# Altium schematic sheet CONTROL_BOARD_V2.SchDoc
size A3
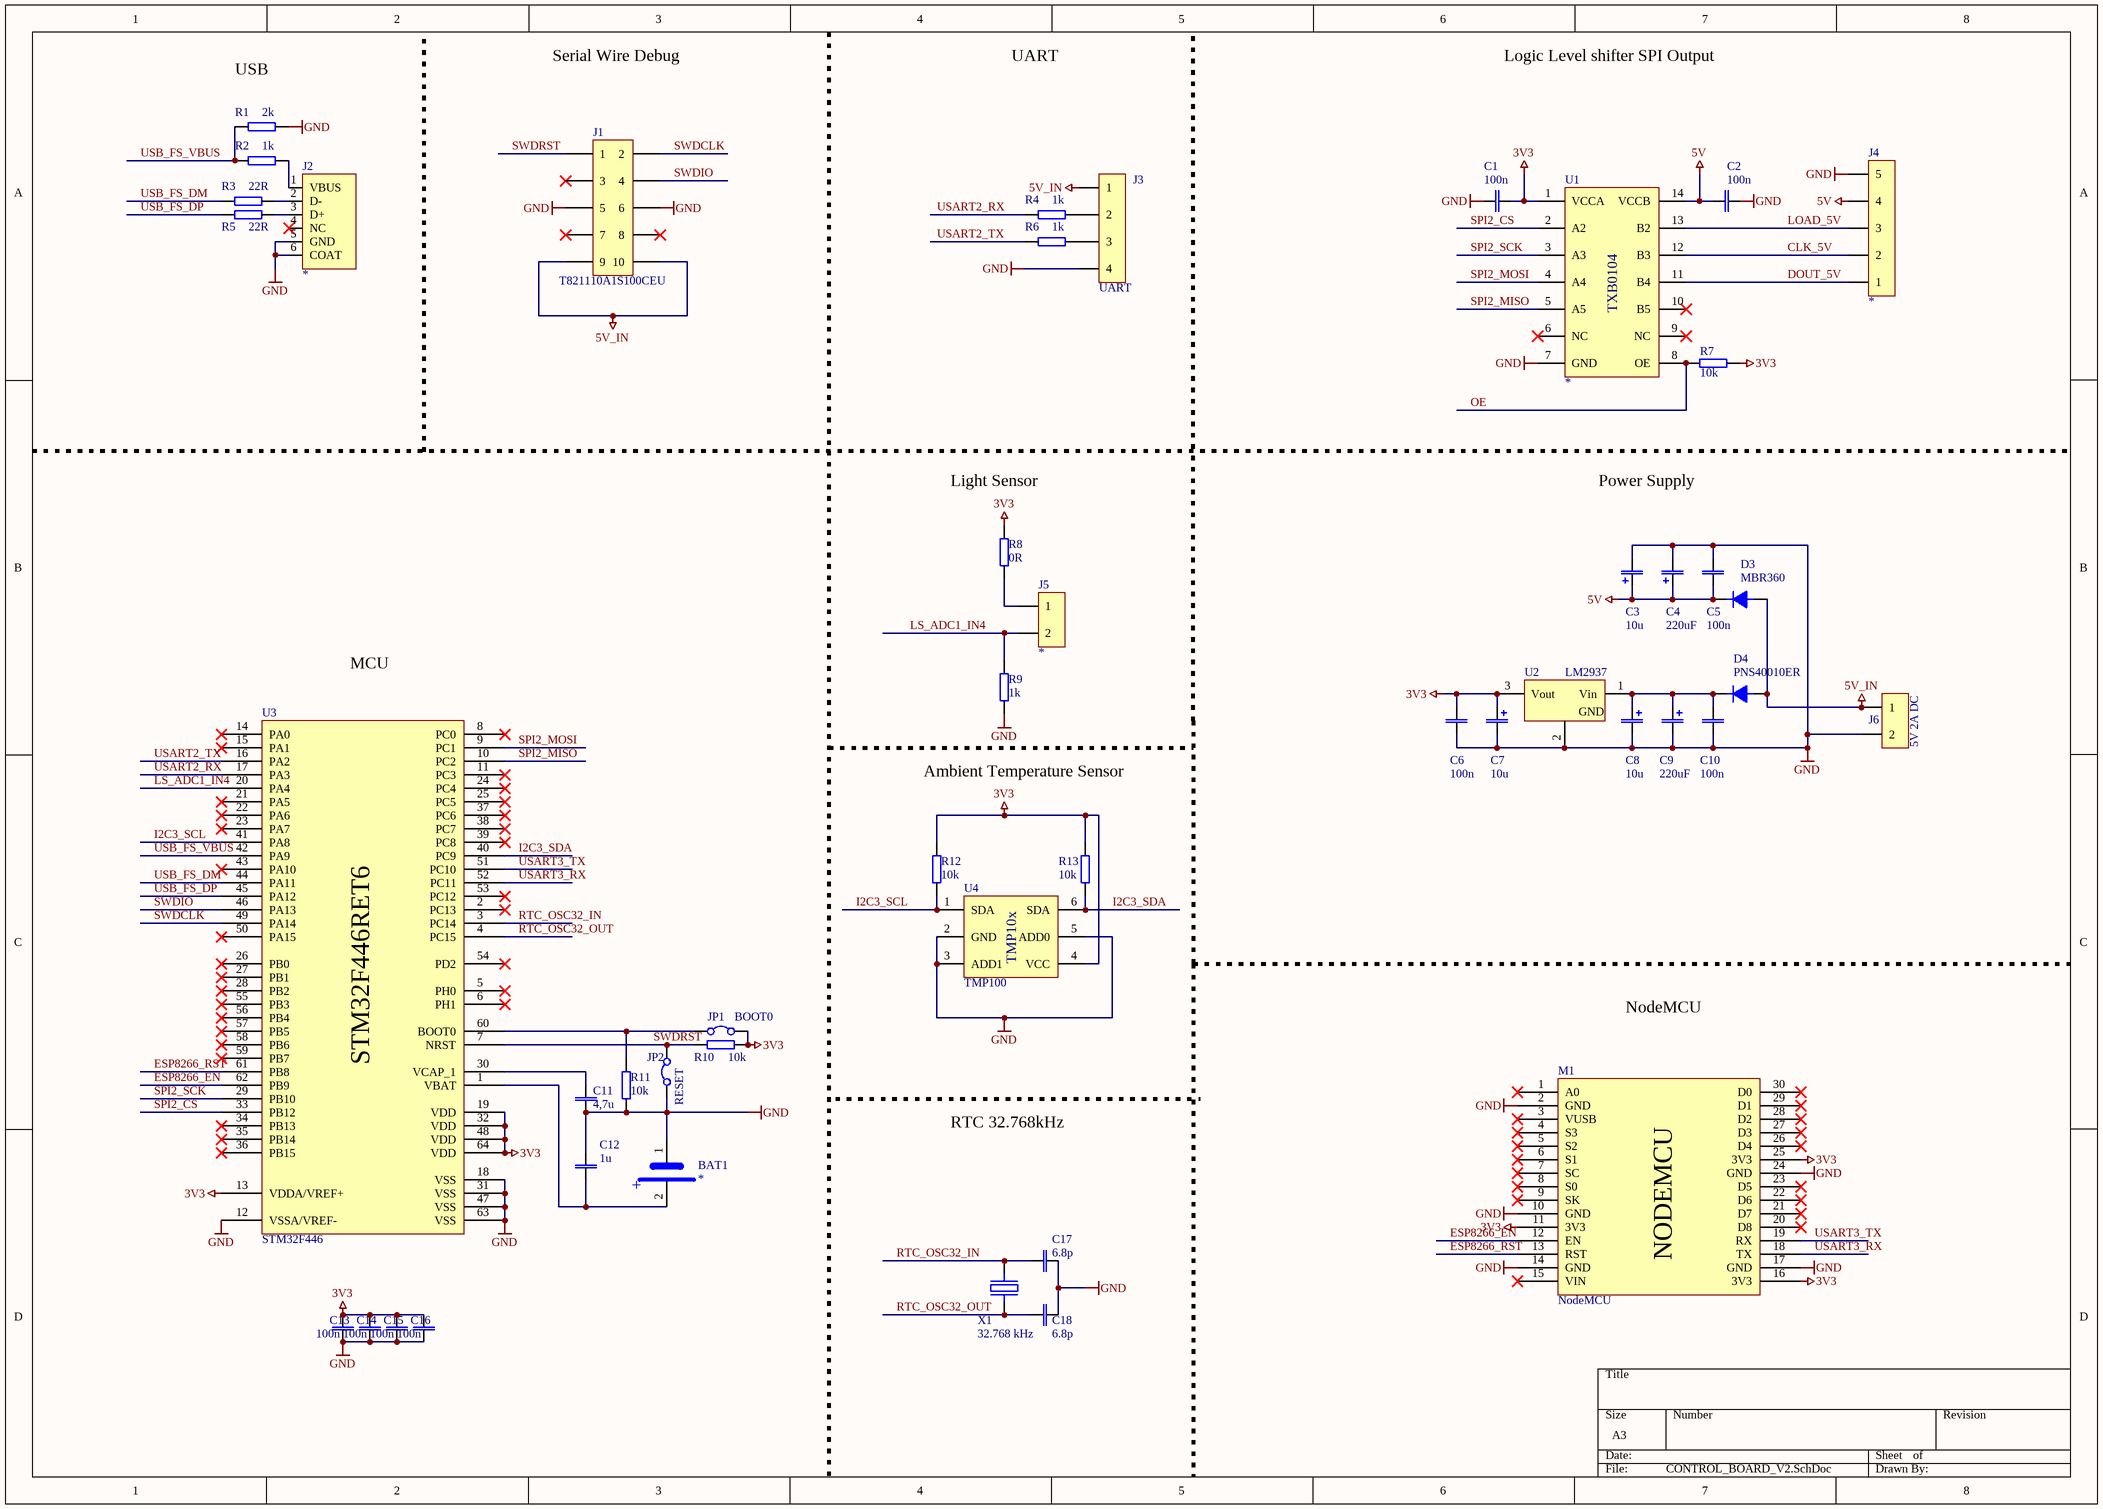
[diagram p0: CONTROL_BOARD_V2.SchDoc]

## Parts
BAT1  *  [CR2032]
C1  100n  [CAP 0805]
C2  100n  [CAP 0805]
C3  10u  [CAP 1210]
C4  220uF  [G ELKO]
C5  100n  [CAP 0805]
C6  100n  [CAP 0805]
C7  10u  [CAP 1210]
C8  10u  [CAP 1210]
C9  220uF  [G ELKO]
C10  100n  [CAP 0805]
C11  4,7u  [CAP 0805]
C12  1u  [CAP 0805]
C13  100n  [CAP 0805]
C14  100n  [CAP 0805]
C15  100n  [CAP 0805]
C16  100n  [CAP 0805]
C17  6.8p  [CAP 0805]
C18  6.8p  [CAP 0805]
D3  MBR360  [DO-201AD]
D4  PNS40010ER  [SOD-123]
J1  T821110A1S100CEU  [MLW10]
J2  *  [MUSB-B2.0S05PFHSB-T]
J3  UART  [SIL4]
J4  *  [SIL5]
J5  *  [SIL2]
J6  5V 2A DC  [PTR_AKZ350]
JP1  BOOT0  [SIL2]
JP2  RESET  [SIL2]
M1  NodeMCU  [NodeMcu]
R1  2k  [RES 0805]
R2  1k  [RES 0805]
R3  22R  [RES 0805]
R4  1k  [RES 0805]
R5  22R  [RES 0805]
R6  1k  [RES 0805]
R7  10k  [RES 0805]
R8  0R  [RES 0805]
R9  1k  [RES 0805]
R10  10k  [RES 0805]
R11  10k  [RES 0805]
R12  10k  [RES 0805]
R13  10k  [RES 0805]
U1  *  [SO14]
U2  LM2937  [SOT223]
U3  STM32F446  [LQFP64]
U4  TMP100  [SOT-23-6L]
X1  32.768 kHz  [X32K768L104]

## Nets
3V3: C1.2 C6.1 C7.1(+) C13.2 C14.2 C15.2 C16.2 JP1.2 M1.11(3V3) M1.16(3V3) M1.25(3V3) R7.1 R8.1 R10.2 R12.2 R13.2 U1.1(VCCA) U2.3(Vout) U3.13(VDDA/VREF+) U3.19(VDD) U3.32(VDD) U3.48(VDD) U3.64(VDD) U4.4(VCC)
5V: C2.1 C3.1(+) C4.1(+) C5.2 D3.2(K) J4.4 U1.14(VCCB)
5V_IN: D3.1(A) D4.1(A) J1.9 J1.10 J3.1 J6.1
GND: BAT1.1 C1.1 C2.2 C3.2(-) C4.2(-) C5.1 C6.2 C7.2(-) C8.2(-) C9.2(-) C10.2 C11.1 C12.1 C13.1 C14.1 C15.1 C16.1 C17.1 C18.1 J1.5 J1.6 J2.5(GND) J2.6(COAT) J3.4 J4.5 J6.2 JP2.1 M1.2(GND) M1.10(GND) M1.14(GND) M1.17(GND) M1.24(GND) R1.1 R9.2 R11.1 U1.7(GND) U2.2(GND) U3.12(VSSA/VREF-) U3.18(VSS) U3.31(VSS) U3.47(VSS) U3.63(VSS) U4.2(GND) U4.3(ADD1) U4.5(ADD0)
CLK_5V: J4.2 U1.12(B3)
DOUT_5V: J4.1 U1.11(B4)
ESP8266_EN: M1.12(EN) U3.62(PB9)
ESP8266_RST: M1.13(RST) U3.61(PB8)
I2C3_SCL: R12.1 U3.41(PA8) U4.1(SDA)
I2C3_SDA: R13.1 U3.40(PC9) U4.6(SDA)
LOAD_5V: J4.3 U1.13(B2)
LS_ADC1_IN4: J5.2 R9.1 U3.20(PA4)
OE: R7.2 U1.8(OE)
RTC_OSC32_IN: C17.2 U3.3(PC14) X1.2(GND)
RTC_OSC32_OUT: C18.2 U3.4(PC15) X1.1
SPI2_CS: U1.2(A2) U3.33(PB12)
SPI2_MISO: U1.5(A5) U3.10(PC2)
SPI2_MOSI: U1.4(A4) U3.9(PC1)
SPI2_SCK: U1.3(A3) U3.29(PB10)
SWDCLK: J1.2 U3.49(PA14)
SWDIO: J1.4 U3.46(PA13)
SWDRST: J1.1 JP2.2 R10.1 U3.7(NRST)
USART2_RX: R4.2 U3.17(PA3)
USART2_TX: R6.2 U3.16(PA2)
USART3_RX: M1.18(TX) U3.52(PC11)
USART3_TX: M1.19(RX) U3.51(PC10)
USB_FS_DM: R3.2 U3.44(PA11)
USB_FS_DP: R5.2 U3.45(PA12)
USB_FS_VBUS: R1.2 R2.2 U3.42(PA9)
NetBAT1_2: BAT1.2 C12.2 U3.1(VBAT)
NetC8_1: C8.1(+) C9.1(+) C10.1 D4.2(K) U2.1(Vin)
NetC11_2: C11.2 U3.30(VCAP_1)
NetJ2_1: J2.1(VBUS) R2.1
NetJ2_2: J2.2(D-) R3.1
NetJ2_3: J2.3(D+) R5.1
NetJ3_2: J3.2 R4.1
NetJ3_3: J3.3 R6.1
NetJ5_1: J5.1 R8.2
NetJP1_1: JP1.1 R11.2 U3.60(BOOT0)

Not connected (* = marked no-connect by the designer): J1 3* 7* 8*; J2 4(NC)*; M1 1(A0)* 3(VUSB)* 4(S3)* 5(S2)* 6(S1)* 7(SC)* 8(S0)* 9(SK)* 15(VIN)* 20(D8)* 21(D7)* 22(D6)* 23(D5)* 26(D4)* 27(D3)* 28(D2)* 29(D1)* 30(D0)*; U1 6(NC)* 9(NC)* 10(B5)*; U3 2(PC13)* 5(PH0)* 6(PH1)* 8(PC0)* 11(PC3)* 14(PA0)* 15(PA1)* 21(PA5)* 22(PA6)* 23(PA7)* 24(PC4)* 25(PC5)* 26(PB0)* 27(PB1)* 28(PB2)* 34(PB13)* 35(PB14)* 36(PB15)* 37(PC6)* 38(PC7)* 39(PC8)* 43(PA10)* 50(PA15)* 53(PC12)* 54(PD2)* 55(PB3)* 56(PB4)* 57(PB5)* 58(PB6)* 59(PB7)*

## Notes on the sheet
- (near R1) USB
- Serial Wire Debug
- UART
- Logic Level shifter SPI Output
- (near R8) Light Sensor
- Power Supply
- MCU
- Ambient Temperature Sensor
- NodeMCU
- RTC 32.768kHz
- (in symbol Battery) +
- (in symbol NodeMCU) NODEMCU

## Library data of the parts
BAT1 = Battery: VALUE: *; DISTRIBUTOR: *; REFERENCE ID: *
C1 C2 C5 C6 C10-C18 = CAP: NON POLARIZED CAPACITOR; REFERENCE ID: *; DISTRIBUTOR: *
  C1 C2 C5 C6 C10 C13-C16: VALUE: 100n
  C11: VALUE: 4,7u
  C12: VALUE: 1u
  C17 C18: VALUE: 6.8p
C3 C4 C7-C9 = CAP_POL: POLARIZED CAPACITOR; Reference ID: *; Distributor: *; Name: *; Manufacture: *
  C3 C7 C8: Value: 10u
  C4 C9: Value: 220uF
D3 = MBR360: ON Semiconductor MBR360,SCHOTTKY BARRIER RECTIFIERS / 3.0 AMPERES 60 VOLTS; Name: MBR360; Value: MBR360; Manufacturer: ON Semiconductor; Distributor: *; Reference ID: *
D4 = PNS40010ER: Nexperia PNS40010ER,115 switching diode 1.4A, 400V, SOD-123; Reference ID: 136-4874; Name: PNS40010ER; Value: PNS40010ER,115; Manufacturer: Nexperia; Distributor: RS Components
J1 = T821-10: T821, 10pin, 2x5 connector, 2.54mm; Manufacturer: Amphenol; Reference ID: 832-3528; Value: T821110A1S100CEU; Name: T821; Distributor: RS Components
J2 = USB_5PIN: 5PIN miniUSB SMD connector; DISTRIBUTOR: LOMEX; REFERENCE ID: 43-28-33; VALUE: *
J3 = HEADER4: 4 PIN HEADER; Value: UART; Name: *; Distributor: *; Reference ID: *; Manufacturer: *
J4 = HEADER5: 5 PIN HEADER; Value: *
J5 = HEADER2: 2 PIN HEADER; REFERENCE ID: *; DISTRIBUTOR: *; VALUE: *
J6 = TB-2: 2 Pin Terminal Block; Manufacturer: TE Connectivity; Reference ID: 710-0100; Value: 282837-2; Distributor: RS Components; Name: 5V 2A DC
JP1 JP2 = JUMPER
  JP1: Name: BOOT0
  JP2: Name: RESET
M1 = NodeMCU: Node MCU ESP12 module; Reference ID: *; Value: *; Distributor: *; Manufacturer: *; Name: NodeMCU
R1-R13 = RES: RESISTOR; REFERENCE ID: *; DISTRIBUTOR: *
  R1: VALUE: 2k
  R2 R4 R6 R9: VALUE: 1k
  R3 R5: VALUE: 22R
  R7 R10-R13: VALUE: 10k
  R8: VALUE: 0R
U1 = TXB0104: Voltage level shifter; REFERENCE ID: *; DISTRIBUTOR: *; VALUE: *
U2 = LM2937: LDO-regulator 400mA 3,3 V 5%, 4,75 → 26 V, SOT223; Manufacturer: Texas Instruments; Reference ID: 761-5599; Value: LM2937IMP-3.3/NOPB; Distributor: RS Components; Name: LM2937
U3 = STM32F446RET6: MCU STM32F446RET6 32bit, ARM Cortex M4, 180MHz, Flash, 128 kB RAM, 2xUSB USB, LQFP-64; Manufacturer: ST Microelectronics; Reference ID: 110-6621; Name: STM32F446; Value: STM32F446RET6; Distributor: RS Components
U4 = TMP10x: Temperature sensor with I2C interface; Manufacturer: Texas Instruments; Distributor: *; Name: TMP100; Reference ID: *; Value: TMP100
X1 = X32K768L104: Crystal, 32.768 kHz, Cylinder Radial, 8mm x 3mm Dia, 12.5 pF, 20 ppm; Manufacturer: AEL CRYSTALS; Reference ID: 9509682; Name: X32K768L104; Distributor: Farnell; Value: 32.768 kHz